# Altium schematic sheet CAN.SchDoc
size A4; SheetNumber: 5; SheetTotal: 5
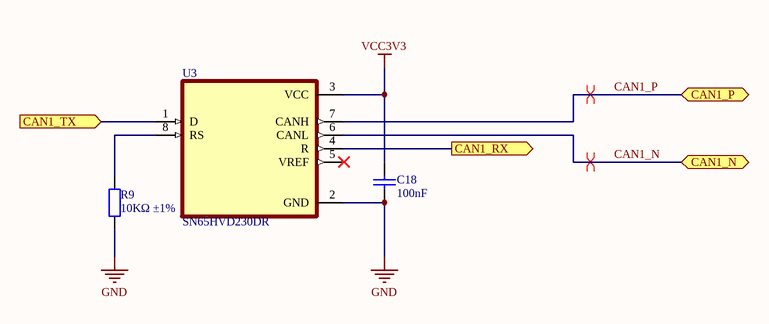
[diagram p0: CAN.SchDoc]

## Parts
C18  100nF  [0402_C]
R9  10KΩ ±1%  [0402_R]
U3  SN65HVD230DR  [SOIC127P599X175-8N]

## Ports
CAN1_N (bidir, see MCU[6B], Connectors[2D], MCU[6B]), CAN1_P (bidir, see MCU[6B], Connectors[2D], MCU[6B]), CAN1_RX (out, see MCU[6B]), CAN1_TX (in, see MCU[6B])

## Nets
GND: C18.2 R9.1 U3.2(GND)
VCC3V3: C18.1 U3.3(VCC)
CAN1_N: U3.6(CANL) ; port CAN1_N
CAN1_P: U3.7(CANH) ; port CAN1_P
CAN1_RX: U3.4(R) ; port CAN1_RX
CAN1_TX: U3.1(D) ; port CAN1_TX
NetR9_2: R9.2 U3.8(RS)

Not connected (* = marked no-connect by the designer): U3 5(VREF)*

## Layout directives
differential pair: CAN1_N, CAN1_P

## Library data of the parts
C18 = 0402 100nF (104) 10% 16V: Chip capacitors; Manufacturer: Samsung Electro-Mechanics; PartNumber: CL05B104KO5NNNC; Tolerance: 10%; Voltage: 16V; ComponentLink1Description: Supplier link; ComponentLink1URL: http://www.szlcsc.com/product/details_1877.html; Package: 0402; Supplier: LC; SuppliersPartNumber: C1525; Capacitance: 100nF
R9 = 0402 10K (1002) 1%: Chip resistor; Manufacturer: Uniroyal Elec; PartNumber: 0402WGF1002TCE; Power: 1/16W; ComponentLink1Description: Supplier link; ComponentLink1URL: http://www.szlcsc.com/product/details_26487.html; Package: 0402; Supplier: LC; SuppliersPartNumber: C25744; Resistance: 10KΩ; Tolerance: 1%
U3 = SN65HVD230DR: 3.3 V CAN Transceiver with Standby Mode; MF: Texas Instruments; Availability: In Stock; SnapEDA_Link: https://www.snapeda.com/parts/SN65HVD230DR/Texas+Instruments/view-part/?ref=snap; Price: None; Check_prices: https://www.snapeda.com/parts/SN65HVD230DR/Texas+Instruments/view-part/?ref=eda; Package: SOIC-8 Texas Instruments; MP: SN65HVD230DR; Value: *; Purchase-URL: https://pricing.snapeda.com/search/part/SN65HVD230DR/?ref=eda